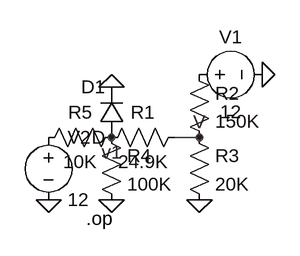
[diagram p0: schematic Draft3.asc]
Draft3.asc, the LTspice schematic file:
Version 4
SHEET 1 880 680
WIRE 144 176 112 176
FLAG 144 256 0
FLAG 224 96 0
FLAG 32 256 0
FLAG 144 176 V
FLAG -48 256 0
FLAG 32 176 v1
FLAG 32 112 0
SYMBOL res 128 160 R90
WINDOW 0 0 56 VBottom 2
WINDOW 3 32 56 VTop 2
SYMATTR InstName R1
SYMATTR Value 24.9K
SYMBOL res 128 80 R0
SYMATTR InstName R2
SYMATTR Value 150K
SYMBOL res 128 160 R0
SYMATTR InstName R3
SYMATTR Value 20K
SYMBOL voltage 128 96 R270
WINDOW 0 32 56 VTop 2
WINDOW 3 -32 56 VBottom 2
WINDOW 123 0 0 Left 0
WINDOW 39 0 0 Left 0
SYMATTR InstName V1
SYMATTR Value 12
SYMBOL res 48 160 R90
WINDOW 0 0 56 VBottom 2
WINDOW 3 32 56 VTop 2
SYMATTR InstName R5
SYMATTR Value 10K
SYMBOL voltage -48 160 R0
WINDOW 123 0 0 Left 0
WINDOW 39 0 0 Left 0
SYMATTR InstName V2
SYMATTR Value 12
SYMBOL res 16 160 R0
SYMATTR InstName R4
SYMATTR Value 100K
SYMBOL diode 48 176 R180
WINDOW 0 24 64 Left 2
WINDOW 3 24 0 Left 2
SYMATTR InstName D1
TEXT 0 280 Left 2 !.op

The netlist it stands for:
* Draft3.asc
R1 V v1 24.9K
R2 P001 V 150K
R3 V 0 20K
V1 P001 0 12
R5 v1 P002 10K
V2 P002 0 12
R4 v1 0 100K
D1 v1 0 D
.model D D
.lib standard.dio
.op
.backanno
.end